# Altium schematic sheet 08_CoreBoard.SchDoc
size A3
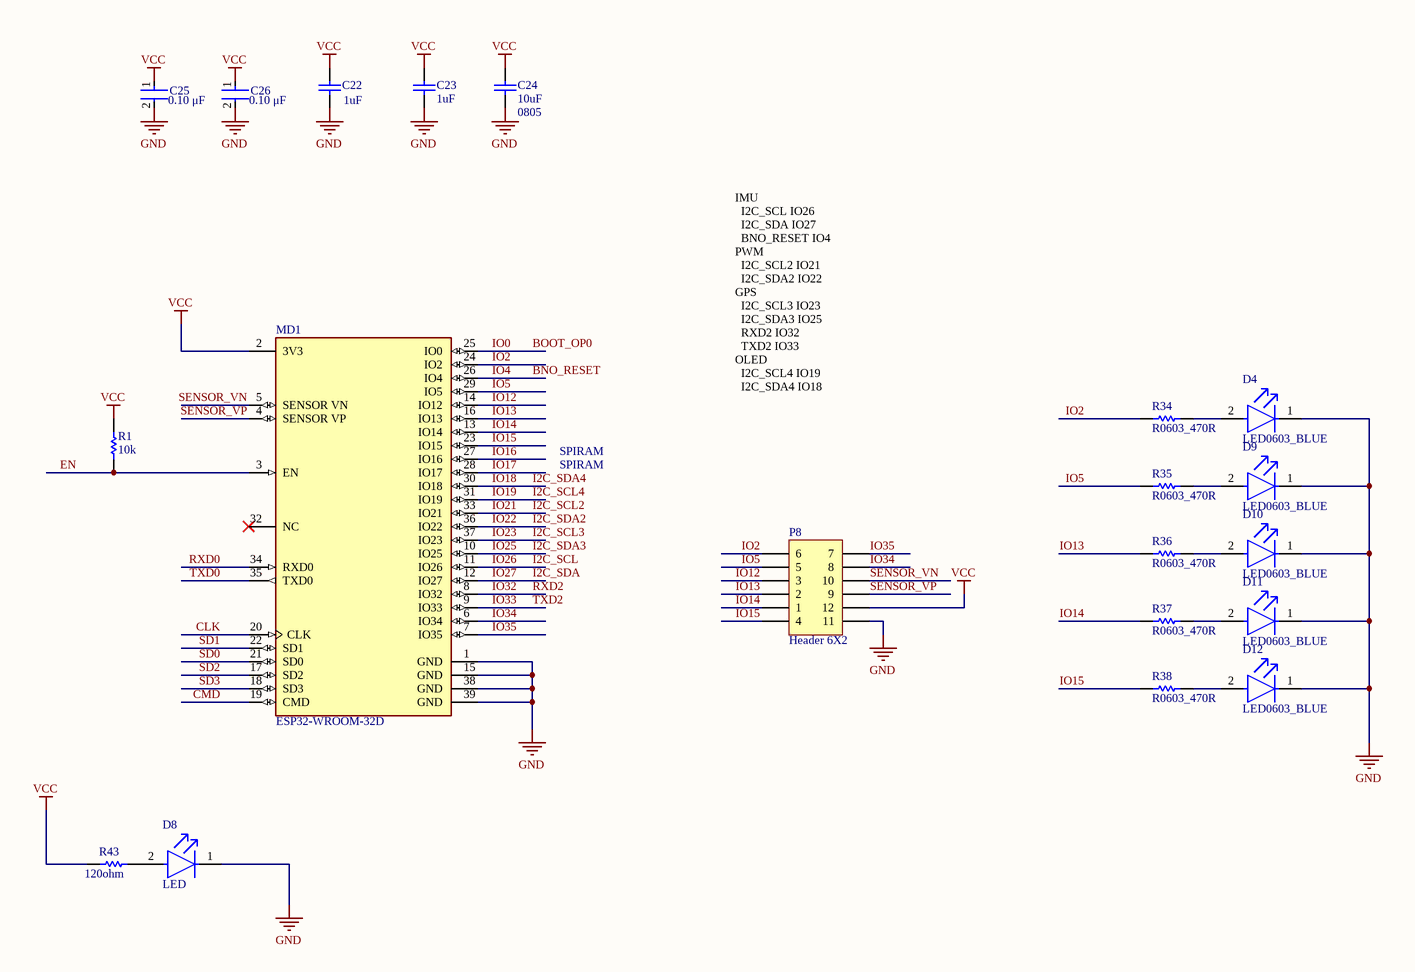
[diagram p0: 08_CoreBoard.SchDoc]

## Parts
C22  value 1uF  [CAPC1608X87X35LL15T15]  (hidden comment: C0603_1UF)
C23  value 1uF  [CAPC1608X87X35LL15T15]  (hidden comment: C0603_1UF)
C24  value 10uF  Package: 0805  [CAPC2013X135X50LL10T20]  (hidden comment: C0805_10UF)
C25  Capacitance: 0.10 μF  [FP-C0603C-CF-MFG]  (hidden comment: C0603_0.1UF)
C26  Capacitance: 0.10 μF  [FP-C0603C-CF-MFG]  (hidden comment: C0603_0.1UF)
D4  LED0603_BLUE  [FP-LTST-C191TBKT-MFG]
D8  LED  [FP-LTST-C190GKT-MFG]
D9  LED0603_BLUE  [FP-LTST-C191TBKT-MFG]
D10  LED0603_BLUE  [FP-LTST-C191TBKT-MFG]
D11  LED0603_BLUE  [FP-LTST-C191TBKT-MFG]
D12  LED0603_BLUE  [FP-LTST-C191TBKT-MFG]
MD1  ESP32-WROOM-32D  [FP-ESP32-WROOM-32D-MFG]
P8  Header 6X2  [HDR2X6]
R1  value 10k  [RESC1609X55X30LL15T15]  (hidden comment: R0603_10K)
R34  R0603_470R  [RESC1608X55X30NL15T15]
R35  R0603_470R  [RESC1608X55X30NL15T15]
R36  R0603_470R  [RESC1608X55X30NL15T15]
R37  R0603_470R  [RESC1608X55X30NL15T15]
R38  R0603_470R  [RESC1608X55X30NL15T15]
R43  value 120ohm  [RESC1608X55X30NL20T20]  (hidden comment: R0603_120R)

## Nets
GND: C22.1 C23.1 C24.1 C25.2 C26.2 D4.1(C) D8.1(C) D9.1(C) D10.1(C) D11.1(C) D12.1(C) MD1.1(GND) MD1.15(GND) MD1.38(GND) MD1.39(GND) P8.11
VCC: C22.2 C23.2 C24.2 C25.1 C26.1 MD1.2(3V3) P8.12 R1.1 R43.1
BNO_RESET: MD1.26(IO4)  [also labelled IO4]
BOOT_OP0: MD1.25(IO0)  [also labelled IO0]
CLK: MD1.20(CLK)
CMD: MD1.19(CMD)
EN: MD1.3(EN) R1.2
I2C_SCL: MD1.11(IO26)  [also labelled IO26]
I2C_SCL2: MD1.33(IO21)  [also labelled IO21]
I2C_SCL3: MD1.37(IO23)  [also labelled IO23]
I2C_SCL4: MD1.31(IO19)  [also labelled IO19]
I2C_SDA: MD1.12(IO27)  [also labelled IO27]
I2C_SDA2: MD1.36(IO22)  [also labelled IO22]
I2C_SDA3: MD1.10(IO25)  [also labelled IO25]
I2C_SDA4: MD1.30(IO18)  [also labelled IO18]
IO2: MD1.24(IO2) P8.6 R34.1
IO5: MD1.29(IO5) P8.5 R35.1
IO12: MD1.14(IO12) P8.3
IO13: MD1.16(IO13) P8.2 R36.1
IO14: MD1.13(IO14) P8.1 R37.1
IO15: MD1.23(IO15) P8.4 R38.1
IO16: MD1.27(IO16)
IO17: MD1.28(IO17)
IO32: MD1.8(IO32)  [also labelled RXD2]
IO33: MD1.9(IO33)  [also labelled TXD2]
IO34: MD1.6(IO34) P8.8
IO35: MD1.7(IO35) P8.7
RXD0: MD1.34(RXD0)
SD0: MD1.21(SD0)
SD1: MD1.22(SD1)
SD2: MD1.17(SD2)
SD3: MD1.18(SD3)
SENSOR_VN: MD1.5(SENSOR_VN) P8.10
SENSOR_VP: MD1.4(SENSOR_VP) P8.9
TXD0: MD1.35(TXD0)
NetD4_2: D4.2(A) R34.2
NetD8_2: D8.2(A) R43.2
NetD9_2: D9.2(A) R35.2
NetD10_2: D10.2(A) R36.2
NetD11_2: D11.2(A) R37.2
NetD12_2: D12.2(A) R38.2

Not connected (* = marked no-connect by the designer): MD1 32(NC)*

## Notes on the sheet
- IMU
  I2C_SCL IO26
  I2C_SDA IO27
  BNO_RESET IO4
  PWM
  I2C_SCL2 IO21
  I2C_SDA2 IO22
  GPS
  I2C_SCL3 IO23
  I2C_SDA3 IO25
  RXD2 IO32
  TXD2 IO33
  OLED
  I2C_SCL4 IO19
  I2C_SDA4 IO18
- SPIRAM
- Title
- Size:
- Date:
- A3
- Number:
- Time:
- Revision:
- Sheet
- of
- File:

## Library data of the parts
C22 C23 = CMP-2006-03318-1: Manufacturer: Kemet; Part Number: C0603C101J1GACTU
C24 = CMP-2007-03453-1: Manufacturer: Murata; Part Number: GRM21BR61C106KE15L
C25 C26 = CMP-03020-016578-1: CAP CER 0.1UF 16V X7R 0603; Manufacturer Part Number: C0603C104M4RAC7411; Manufacturer: KEMET; Tolerance: 0.2; Value: 0.10 μF; Automotive Grade: Grade 1; Material: Ceramic; Temperature Coefficient: 30ppm/°C; RoHS: TRUE; Temperature: -55°C to +125°C; Automotive: Yes; Device Class L3: Ceramic Capacitors; Temperature Characteristic: X7R; Package: C0603C-CF; Digikey Description: CAP CER 0.1UF 16V X7R 0603; ComponentLink2URL: https://api.kemet.com/component-edge/download/datasheet/C0603C100J5GACAUTO.pdf; Mouser Description: Multilayer Ceramic Capacitors MLCC - SMD/SMT 16volts 0.1uF X7R 20%; Voltage Rating: 16 V; Temperature Range High: +125°C; Temperature Range Low: -55°C; Height: 0.87mm; Device Class L1: Passive Components; ComponentLink2Description: Datasheet; Lead Free: Yes; Category: Cap; Device Class L2: Capacitors; Octopart: https://octopart.com/c0603c104m4rac7411-kemet-9138805
D4 D9-D12 = CMP-22017-000008-1: LED BLUE CLEAR CHIP SMD; Lens Color: Colorless; Dominant Wavelength: 475nm; Forward Current: 20mA; Wavelength: 468nm; Viewing Angle: 130°; Power Dissipation: 76mW; Luminous Intensity: 180mcd; Reverse Voltage: 5V; Number of Elements: 1; Lens Style: Diffused; Forward Voltage: 3.8V; Max Power Dissipation: 75mW; Case Code (Metric): 1608; Packaging: Tape and Reel; Case/Package: 0603; Depth: 1.6mm; Mount: Surface Mount; Lead Free: Lead Free; Min Operating Temperature: -20°C; Lens Transparency: Clear; Illumination Color: Blue; Height: 0.55mm; Test Current: 20mA; Case Code (Imperial): 0603; Max Operating Temperature: 80°C; Number of Pins: 2; Length: 0.8mm; Radiation Hardening: No; Package Quantity: 1; Number of LEDs: 1; Width: 0.8mm; Color: Blue
D8 = CMP-22017-000005-1: LED GREEN CLEAR CHIP SMD; Reverse Voltage: 5V; Power Dissipation: 100mW; Forward Voltage: 2.1V; Test Current: 10mA; Number of LEDs: 1; Viewing Angle: 130°; Forward Current: 30mA; Voltage: 2V; Wavelength: 565nm; Dominant Wavelength: 569nm; Luminous Intensity: 6mcd; Lens Color: Colorless; Packaging: Tape and Reel; Lens Transparency: Clear; Min Operating Temperature: -55°C; Case Code (Metric): 1608; Lens Style: Clear; Case/Package: 0603; Mount: Surface Mount; Package Quantity: 1; Height: 0.8mm; Illumination Color: Green; Radiation Hardening: No; Depth: 0.8mm; Number of Pins: 2; Max Operating Temperature: 85°C; Color: Green; Number of Elements: 1; Power Rating: 100mW; Case Code (Imperial): 0603; Width: 0.8mm; Length: 1.6mm; Lead Free: Lead Free
MD1 = CMP-194065-000003-1: WIFI MODULE 32MBITS SPI FLASH; Manufacturer: Espressif Systems; Max Supply Voltage: 3.6V; Nominal Supply Current: 500mA; Max Frequency: 2484MHz; Number Of Adc Channels: 16; Number Of Gpio: 32; Interface: I2C,SPI,UART,Ethernet,I2S,Other; Data Rate: 150Mbits/s; Min Supply Voltage: 3V; Bandwidth: 72MHz; Sensitivity: -98dBm; Octopart: https://octopart.com/esp32-wroom-32d-espressif+systems-91040050; Package: ESP32-WROOM-32D; ComponentLink2URL: https://www.espressif.com/sites/default/files/documentation/esp32-wroom-32d_esp32-wroom-32u_datasheet_en.pdf; Lead Free: Yes; Category: UNK; Mouser Description: Wi-Fi/BT BLE Module ESP32-D0WD, SPI Flash, UART, P; Device Class L1: Integrated Circuits (ICs); RoHS: TRUE; Temperature Range Low: -40°C; ComponentLink2Description: Datasheet; Digikey Description: WIFI MODULE 32MBITS SPI FLASH; Height: 3.2mm; Temperature: -40°C to +85°C; Manufacturer Part Number: ESP32-WROOM-32D; Device Class L3: Transceivers; Device Class L2: RF Semiconductors and Devices; Temperature Range High: +85°C; Automotive: No
P8 = Header 6X2: Header, 6-Pin, Dual row; LatestRevisionDate: 17-Jul-2002; LatestRevisionNote: Re-released for DXP Platform.; Publisher: Altium Limited
R1 = CMP-2000-07452-1: Chip Resistor, 10 KOhm, +/- 1%, 0.1 W, -55 to 155 degC, 0603 (1608 Metric), RoHS, Tape and Reel; Manufacturer: Panasonic; Voltage Rating: 75V; Case\/Package: 0603; Power Rating: 100mW; Resistance: 10KOhm; Temperature Coefficient: 100ppm\/degreesC; Number of Pins: 2; Package Reference: 603; Depth: 0.8mm; Mount: SurfaceMount; Package Description: 2-Pin Surface Mount Device, Body 1.6 x 0.85 mm; Datasheet Version: 02/2017; Length: 1.6mm; Lead Free: LeadFree; Height: 0.45mm; Number of Terminations: 2; Max Power Dissipation: 100mW; Min Operating Temperature: -55degC; Datasheet URL: https://industrial.panasonic.com/cdbs/www-data/pdf/RDA0000/AOA0000C304.pdf; Termination: SMD/SMT; Case Code (Metric): 1608; Case Code (Imperial): 0603; Tolerance: 1%; Max Operating Temperature: 155degC; RoHSCompliant: true; Voltage Rating (DC): 75V; Radiation Hardening: No; Packaging: TapeandReel; Composition: ThickFilm; Mounting Technology: SurfaceMount; Manufacturer URL: http://www.panasonic.com/; Width: 0.031inch; REACH SVHC: NoSVHC; Contact Plating: Tin; Military Standard: Not; Package Quantity: 1
R34-R38 = CMP-2000-00795-1: Part Number: ERJ-3GEYJ471V; Manufacturer: Panasonic; Value: 470
R43 = CMP-2000-00896-1: Part Number: ERA-3AEB121V; Manufacturer: Panasonic